# EAGLE schematic Konekt_Dash_Pro (EAGLE 6.5.0)
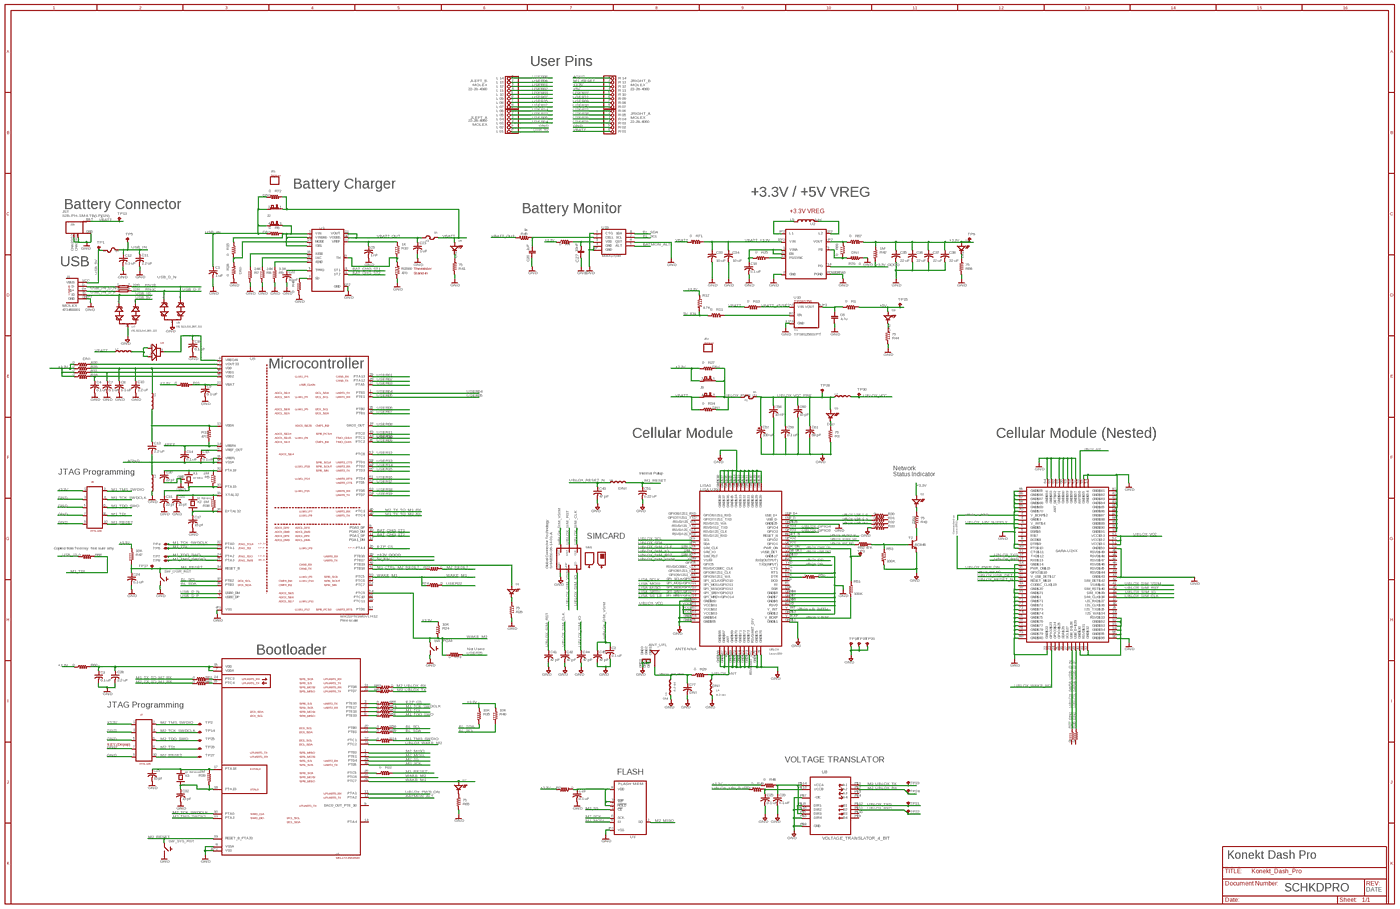
[diagram p0: schematic, sheet 1, overview]
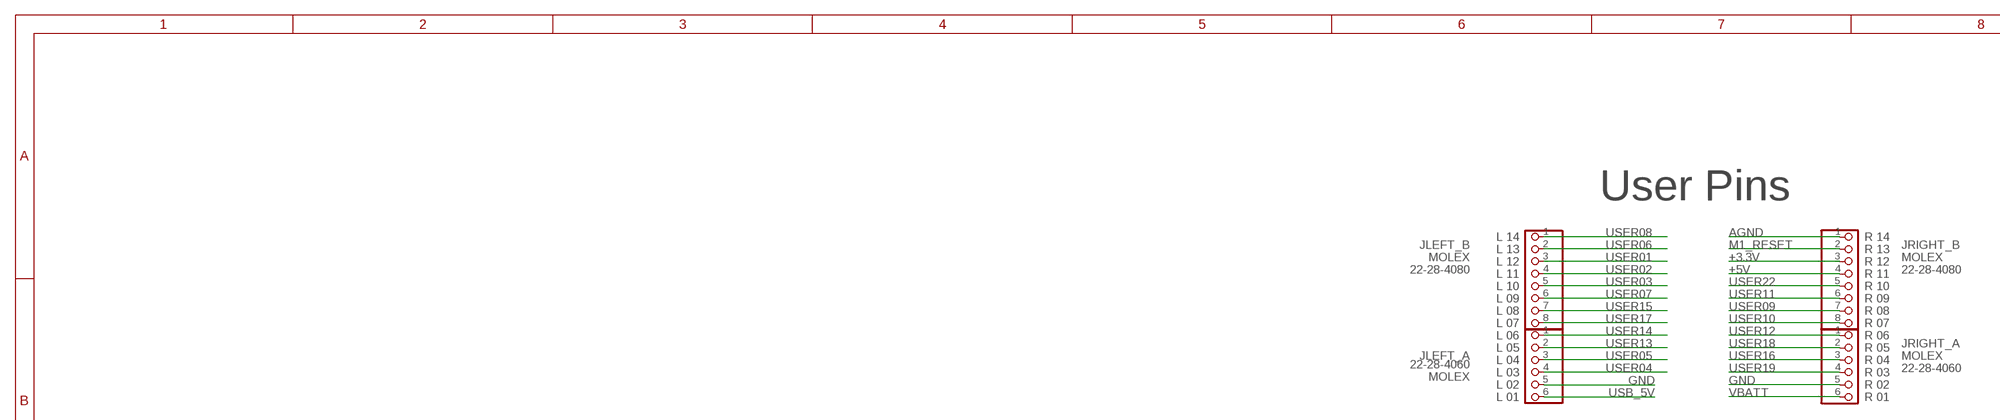
[diagram p1: schematic, sheet 1, part 1 of 4]
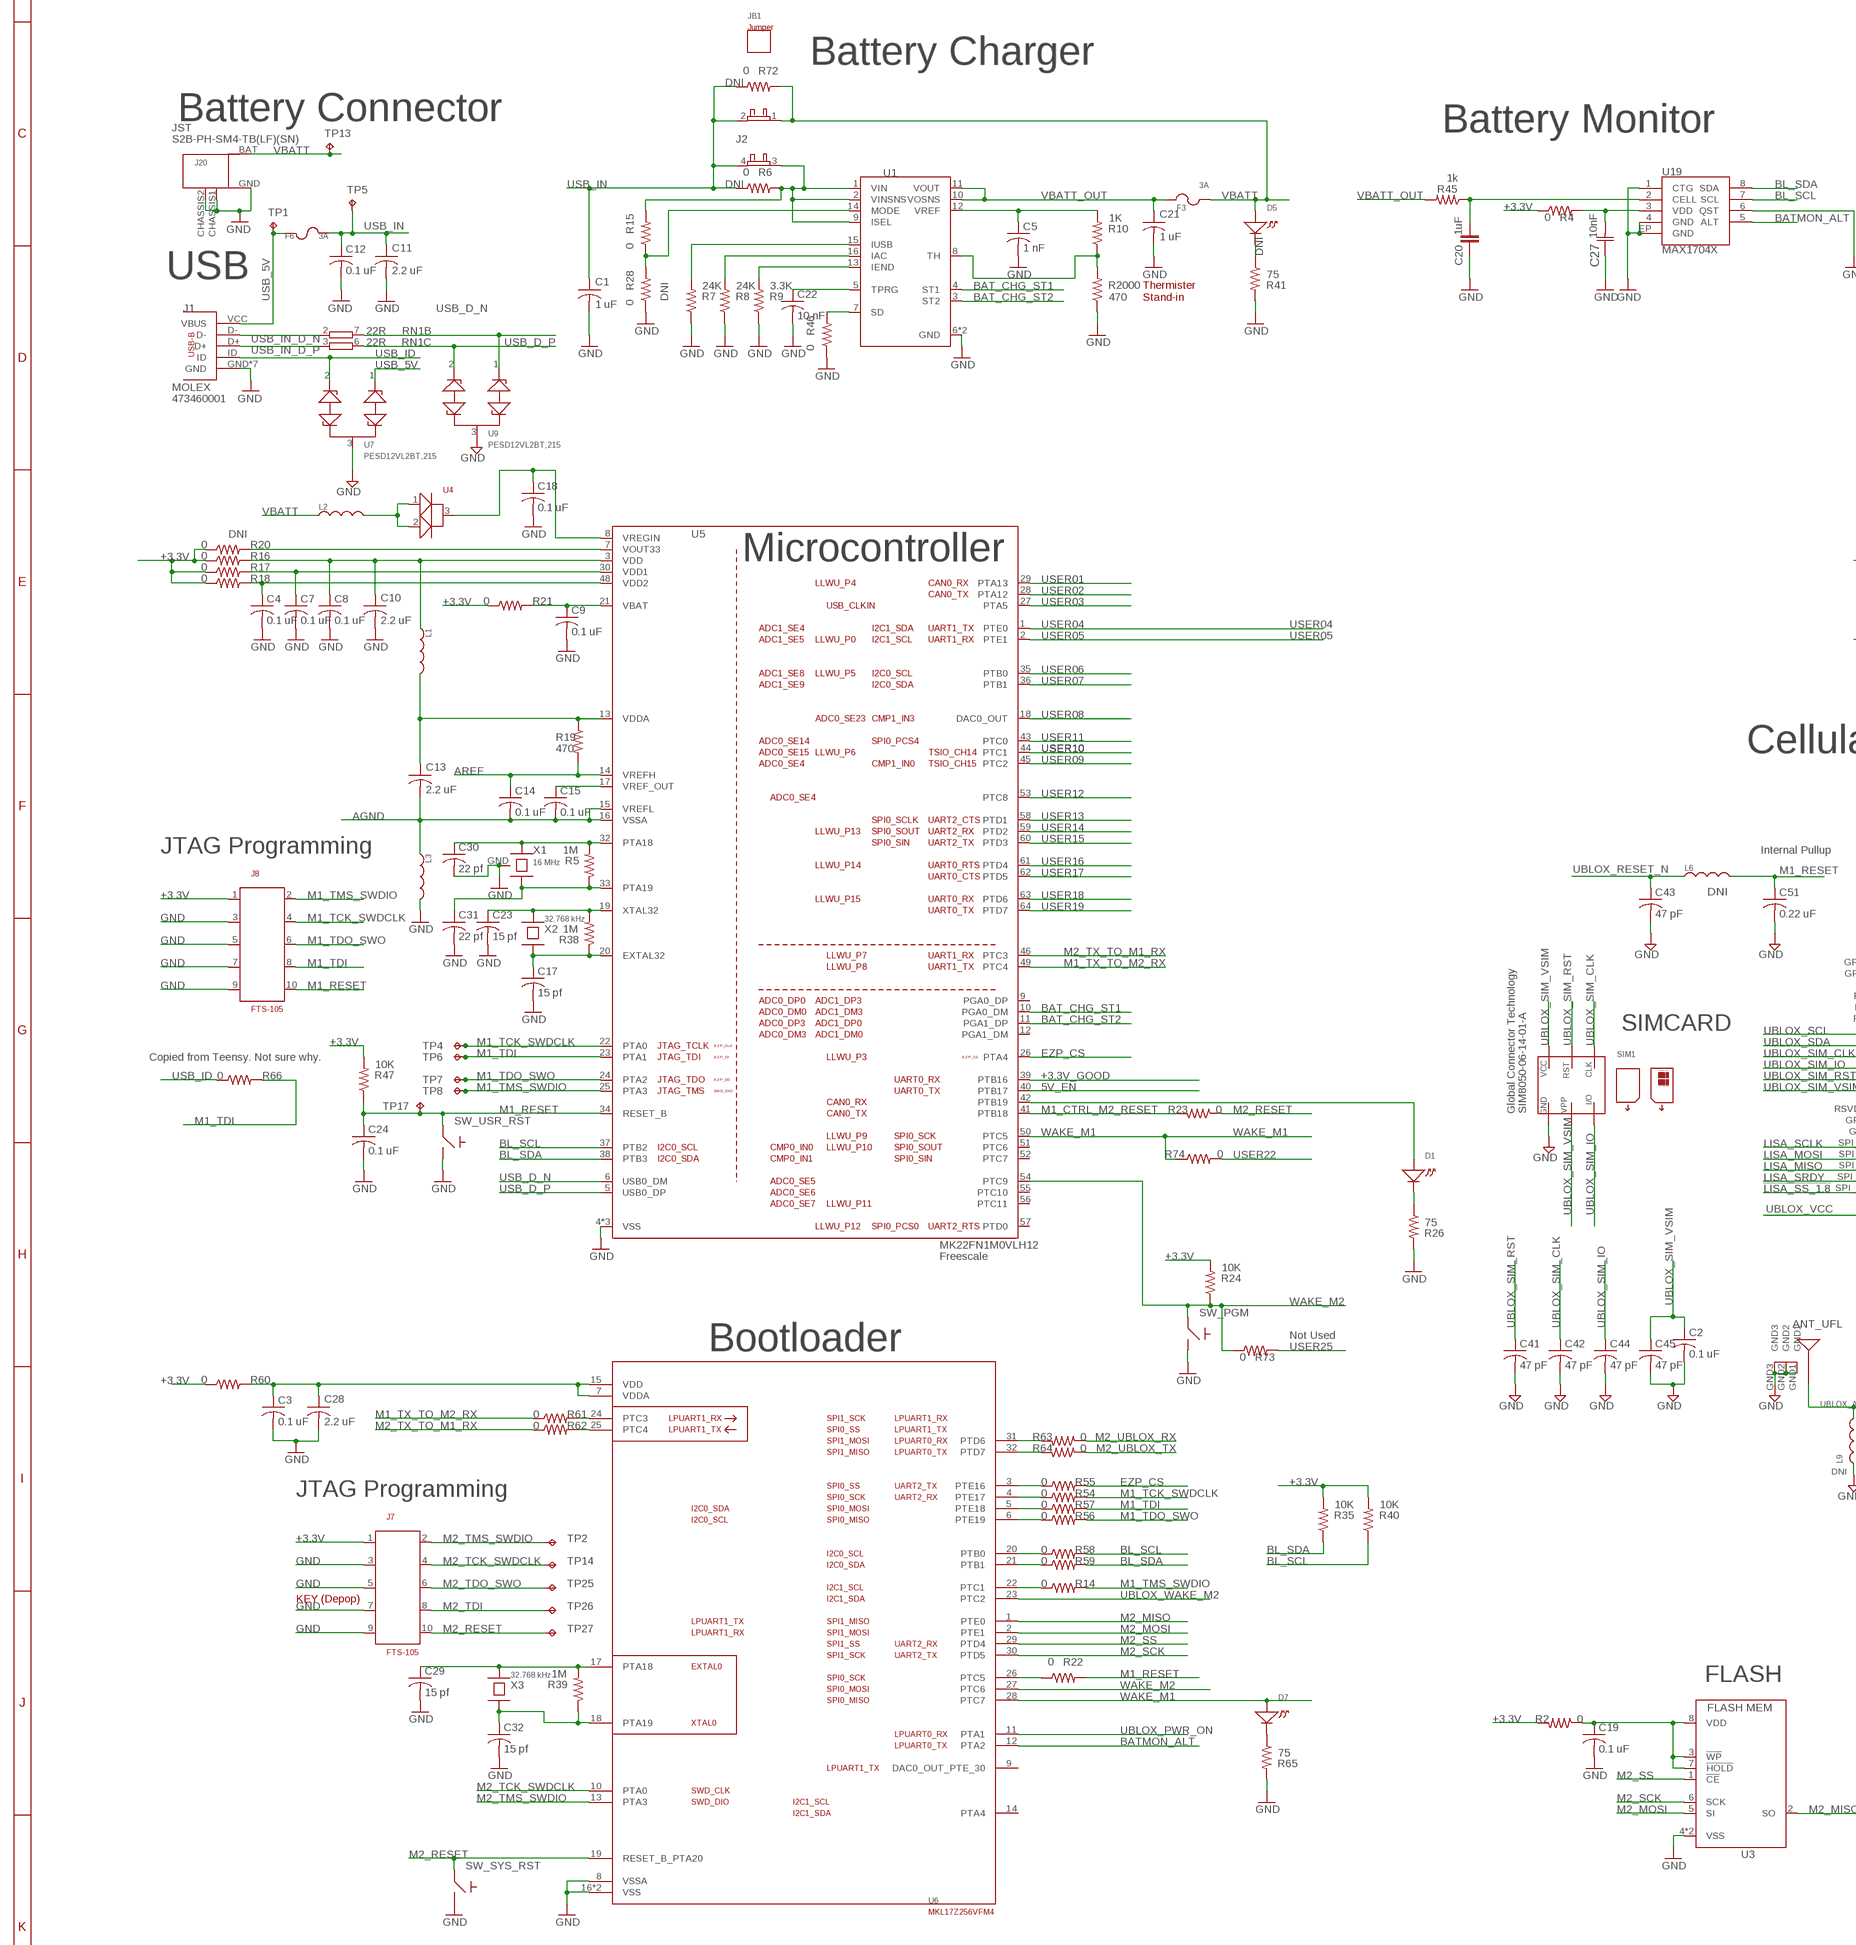
[diagram p2: schematic, sheet 1, part 2 of 4]
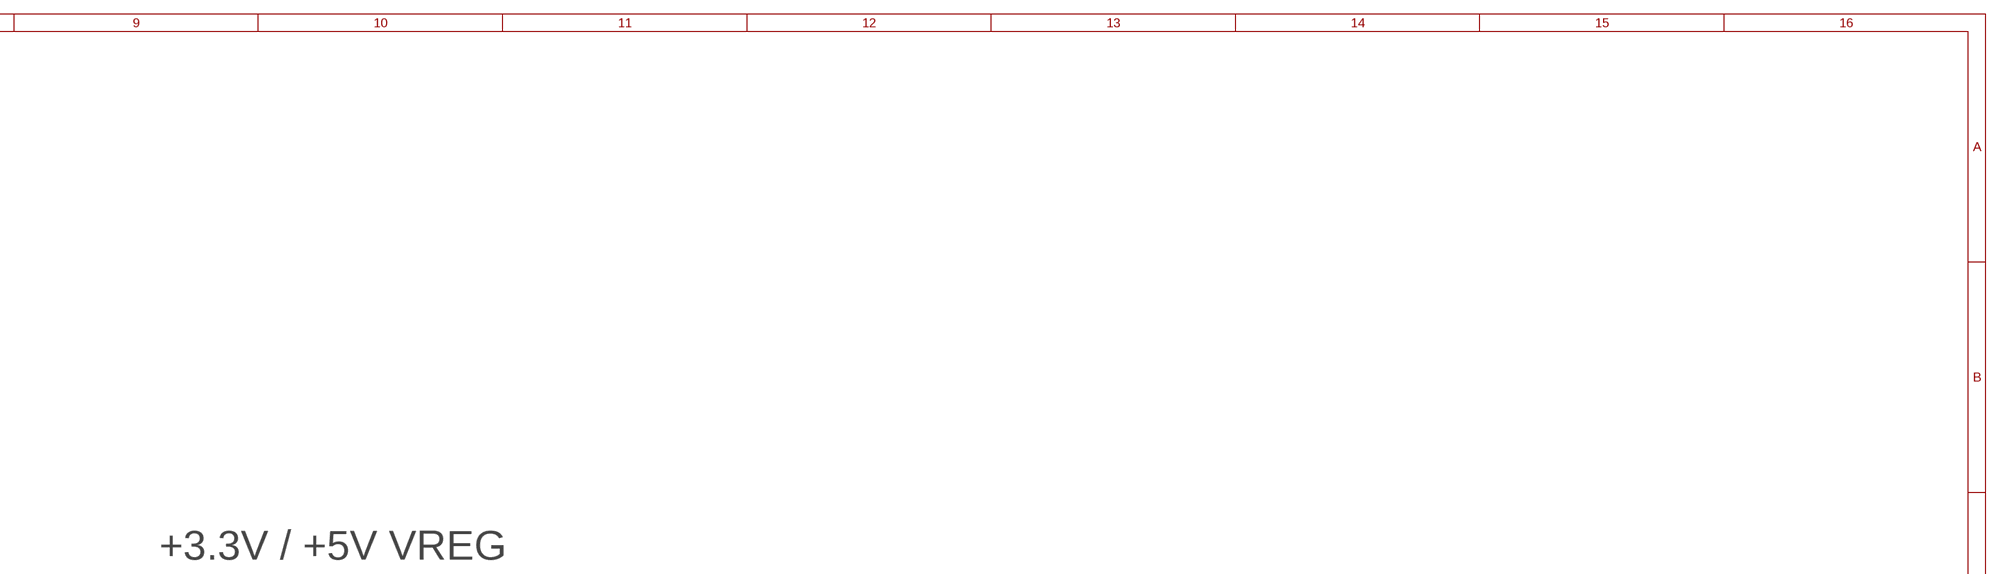
[diagram p3: schematic, sheet 1, part 3 of 4]
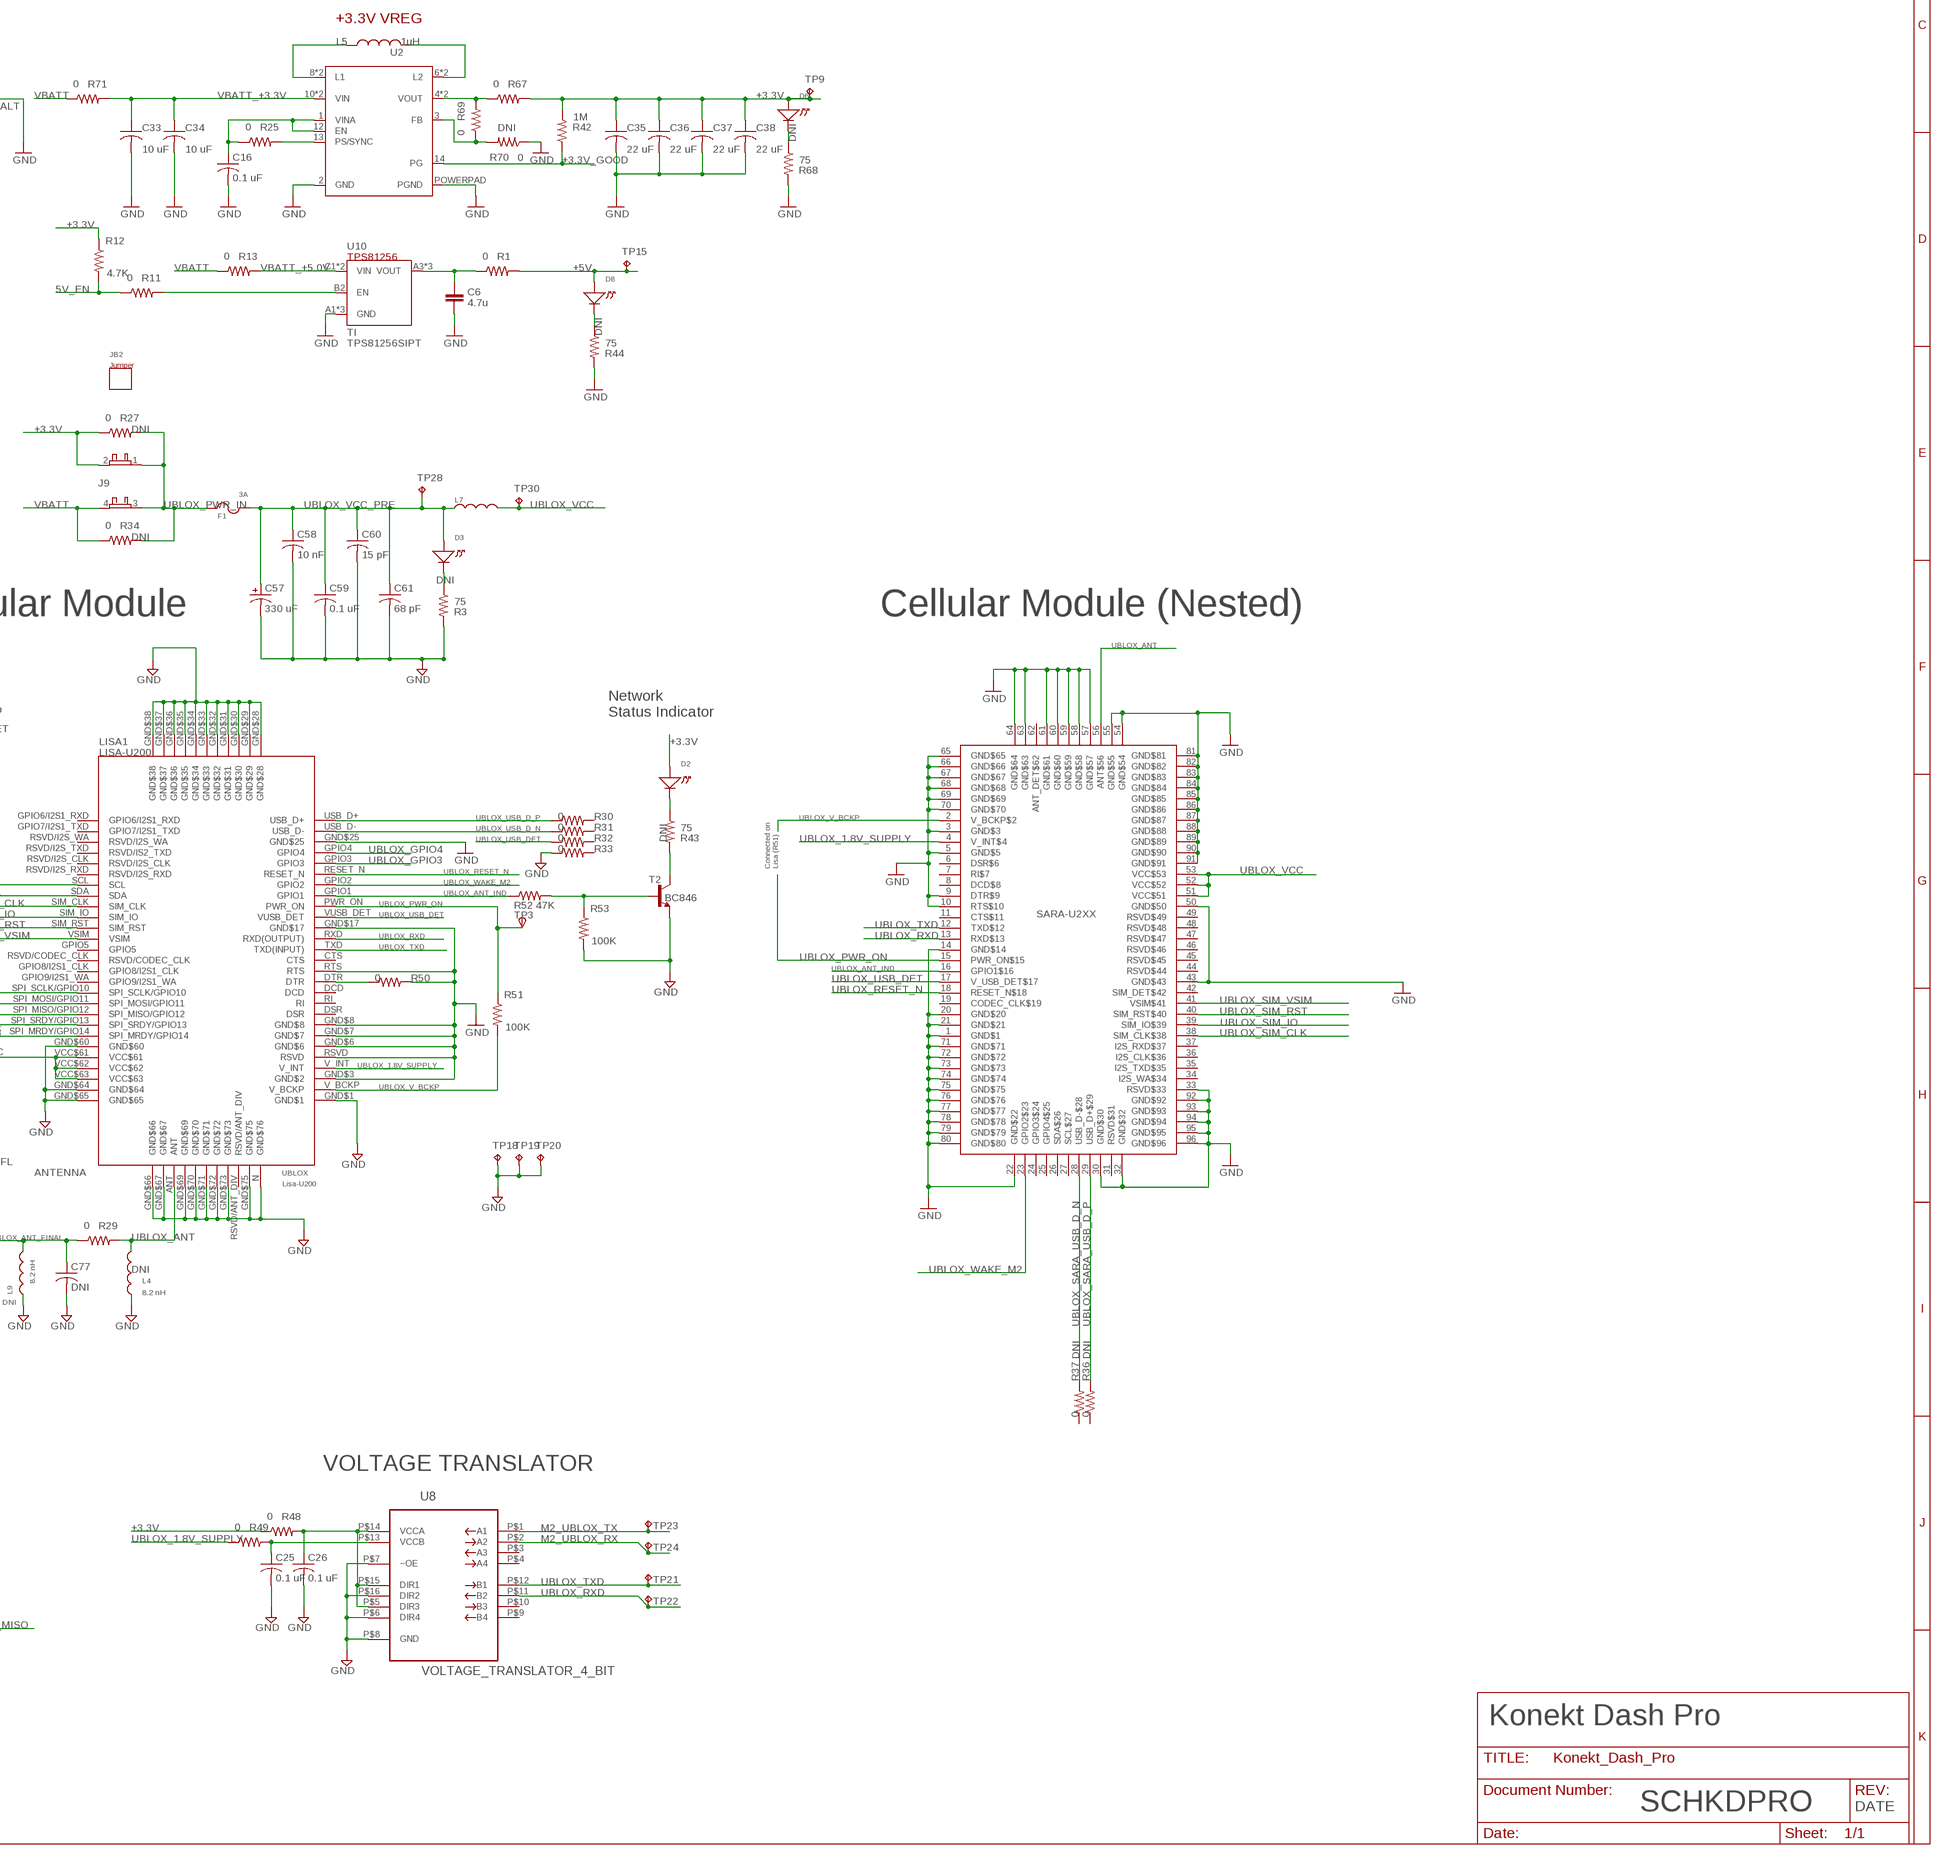
[diagram p4: schematic, sheet 1, part 4 of 4]

## Parts
ANT_UFL  ANT-A-1JB  [UFL]
C1  1 uF  C-USC0603  [C0603]
C2  0.1 uF  C-USC0402  [C0402]
C3  0.1 uF  C-USC0402  [C0402]
C4  0.1 uF  C-USC0402  [C0402]
C5  1 nF  C-USC0402  [C0402]
C6  4.7u  C-EU0603-RND  [C0603-ROUND]
C7  0.1 uF  C-USC0402  [C0402]
C8  0.1 uF  C-USC0402  [C0402]
C9  0.1 uF  C-USC0402  [C0402]
C10  2.2 uF  C-USC0603  [C0603]
C11  2.2 uF  C-USC0603  [C0603]
C12  0.1 uF  C-USC0603  [C0603]
C13  2.2 uF  C-USC0603  [C0603]
C14  0.1 uF  C-USC0402  [C0402]
C15  0.1 uF  C-USC0402  [C0402]
C16  0.1 uF  C-USC0603  [C0603]
C17  15 pf  C-USC0402  [C0402]
C18  0.1 uF  C-USC0402  [C0402]
C19  0.1 uF  C-USC0402  [C0402]
C20  1uF  CAPACITOR0402  [0402-CAP]
C21  1 uF  C-USC0603  [C0603]
C22  10 nF  C-USC0402  [C0402]
C23  15 pf  C-USC0402  [C0402]
C24  0.1 uF  C-USC0402  [C0402]
C25  0.1 uF  C-USC0402  [C0402]
C26  0.1 uF  C-USC0402  [C0402]
C27  10nF  GRM155R71E103KA01D  [CAPC1005X60N]
C28  2.2 uF  C-USC0603  [C0603]
C29  15 pf  C-USC0402  [C0402]
C30  22 pf  C-USC0402  [C0402]
C31  22 pf  C-USC0402  [C0402]
C32  15 pf  C-USC0402  [C0402]
C33  10 uF  C-USC0603  [C0603]
C34  10 uF  C-USC0603  [C0603]
C35  22 uF  C-USC0603  [C0603]
C36  22 uF  C-USC0603  [C0603]
C37  22 uF  C-USC0603  [C0603]
C38  22 uF  C-USC0603  [C0603]
C41  47 pF  C-USC0402  [C0402]
C42  47 pF  C-USC0402  [C0402]
C43  47 pF  C-USC0402  [C0402]
C44  47 pF  C-USC0402  [C0402]
C45  47 pF  C-USC0402  [C0402]
C51  0.22 uF  C-USC0603  [C0603]
C57  330 uF  CAP_SMD_D_SIZED  [CAP_SMD_SIZE_D]
C58  10 nF  C-USC0402  [C0402]
C59  0.1 uF  C-USC0603  [C0603]
C60  15 pF  C-USC0402  [C0402]
C61  68 pF  C-USC0402  [C0402]
C77  DNI  C-USC0402  [C0402]
D1  LED_0402_VLMW  [LED_0402_VISHAY_VLMW]
D2  LED_0402_VLMW  [LED_0402_VISHAY_VLMW]
D3  LED_0402_VLMW  [LED_0402_VISHAY_VLMW]
D5  LED_0402_VLMW  [LED_0402_VISHAY_VLMW]
D6  LED_0402_VLMW  [LED_0402_VISHAY_VLMW]
D7  LED_0402_VLMW  [LED_0402_VISHAY_VLMW]
D8  LED_0402_VLMW  [LED_0402_VISHAY_VLMW]
F1  3A  FUSE_0603  [R0603]
F3  3A  FUSE_0603  [R0603]
F6  3A  FUSE_0603  [R0603]
J1  USB_MICRO_B_MOLEX_473460001  [USB_MICRO_MOLEX_473460001]
J2  CON_JUMPER_1.27_2X2  [FCI_CON_1.27_2X2]
J7  FTS-105  [FTS-105]
J8  FTS-105  [FTS-105]
J9  CON_JUMPER_1.27_2X2  [FCI_CON_1.27_2X2]
J20  BAT_TERM  [JST-PH-2]
JB1  JUMPER_1.27MM  [NOTHING]
JB2  JUMPER_1.27MM  [NOTHING]
JLEFT_A  PINHD-1X6  [1X06]
JLEFT_B  HEADER_0.1_IN_8_POS  [HEADER_0.1_8_POS]
JRIGHT_A  PINHD-1X6  [1X06]
JRIGHT_B  HEADER_0.1_IN_8_POS  [HEADER_0.1_8_POS]
L1  INDUCTOR_0603  [R0603$1]
L2  INDUCTOR_0603  [R0603$1]
L3  INDUCTOR_0603  [R0603$1]
L4  INDUCTOR_0402  [R0402]
L5  1uH  INDUCTOR_1UH_XFL4020-102MEC  [COILCRAFT_XFL4020]
L6  INDUCTOR_0603  [R0603$1]
L7  INDUCTOR_0603  [R0603$1]
L9  INDUCTOR_0402  [R0402]
LISA1  LISA-U200  [76PIN_LCC]
R1  0  RESISTOR0402-RES  [0402-RES]
R2  0  RESISTOR0402-RES  [0402-RES]
R3  75  RESISTOR0402-RES  [0402-RES]
R4  0  RESISTOR0402-RES  [0402-RES]
R5  1M  RESISTOR0402-RES  [0402-RES]
R6  0  RESISTOR0402-RES  [0402-RES]
R7  24K  RESISTOR0402-RES  [0402-RES]
R8  24K  RESISTOR0402-RES  [0402-RES]
R9  3.3K  RESISTOR0402-RES  [0402-RES]
R10  1K  RESISTOR0402-RES  [0402-RES]
R11  0  RESISTOR0402-RES  [0402-RES]
R12  4.7K  R-US_R0402  [R0402]
R13  0  RESISTOR0402-RES  [0402-RES]
R14  0  RESISTOR0402-RES  [0402-RES]
R15  0  RESISTOR0402-RES  [0402-RES]
R16  0  RESISTOR0402-RES  [0402-RES]
R17  0  RESISTOR0402-RES  [0402-RES]
R18  0  RESISTOR0402-RES  [0402-RES]
R19  470  R-US_R0402  [R0402]
R20  0  RESISTOR0402-RES  [0402-RES]
R21  0  RESISTOR0402-RES  [0402-RES]
R22  0  RESISTOR0402-RES  [0402-RES]
R23  0  RESISTOR0402-RES  [0402-RES]
R24  10K  RESISTOR0402-RES  [0402-RES]
R25  0  RESISTOR0402-RES  [0402-RES]
R26  75  RESISTOR0402-RES  [0402-RES]
R27  0  RESISTOR0402-RES  [0402-RES]
R28  0  RESISTOR0402-RES  [0402-RES]
R29  0  RESISTOR0402-RES  [0402-RES]
R30  0  RESISTOR0402-RES  [0402-RES]
R31  0  RESISTOR0402-RES  [0402-RES]
R32  0  RESISTOR0402-RES  [0402-RES]
R33  0  RESISTOR0402-RES  [0402-RES]
R34  0  RESISTOR0402-RES  [0402-RES]
R35  10K  RESISTOR0402-RES  [0402-RES]
R36  0  RESISTOR0402-RES  [0402-RES]
R37  0  RESISTOR0402-RES  [0402-RES]
R38  1M  RESISTOR0402-RES  [0402-RES]
R39  1M  RESISTOR0402-RES  [0402-RES]
R40  10K  RESISTOR0402-RES  [0402-RES]
R41  75  RESISTOR0402-RES  [0402-RES]
R42  1M  RESISTOR0402-RES  [0402-RES]
R43  75  RESISTOR0402-RES  [0402-RES]
R44  75  RESISTOR0402-RES  [0402-RES]
R45  1k  RESISTOR  [0402-RES]
R46  0  RESISTOR0402-RES  [0402-RES]
R47  10K  RESISTOR0402-RES  [0402-RES]
R48  0  RESISTOR0402-RES  [0402-RES]
R49  0  RESISTOR0402-RES  [0402-RES]
R50  0  RESISTOR0402-RES  [0402-RES]
R51  100K  R-US_R0402  [R0402]
R52  47K  R-US_R0402  [R0402]
R53  100K  R-US_R0402  [R0402]
R54  0  RESISTOR0402-RES  [0402-RES]
R55  0  RESISTOR0402-RES  [0402-RES]
R56  0  RESISTOR0402-RES  [0402-RES]
R57  0  RESISTOR0402-RES  [0402-RES]
R58  0  RESISTOR0402-RES  [0402-RES]
R59  0  RESISTOR0402-RES  [0402-RES]
R60  0  RESISTOR0402-RES  [0402-RES]
R61  0  RESISTOR0402-RES  [0402-RES]
R62  0  RESISTOR0402-RES  [0402-RES]
R63  0  RESISTOR0402-RES  [0402-RES]
R64  0  RESISTOR0402-RES  [0402-RES]
R65  75  RESISTOR0402-RES  [0402-RES]
R66  0  RESISTOR0402-RES  [0402-RES]
R67  0  RESISTOR0402-RES  [0402-RES]
R68  75  RESISTOR0402-RES  [0402-RES]
R69  0  RESISTOR0402-RES  [0402-RES]
R70  0  RESISTOR0402-RES  [0402-RES]
R71  0  RESISTOR0402-RES  [0402-RES]
R72  0  RESISTOR0402-RES  [0402-RES]
R73  0  RESISTOR0402-RES  [0402-RES]
R74  0  RESISTOR0402-RES  [0402-RES]
R2000  470  RESISTOR0402-RES  [0402-RES]
RN1  22R  4R-NCAY16  [CAY16]
SARA1  SARA-U2XX  [91-PIN_LGA]
SIM1  SIM_CARD_NANO_GLOBAL_CONNECTOR_TEC_SIM8050-6-0-14-01-A  [SIM_CARD_NANO]
SW_PGM  SWITCH_PANASONIC_EVP-BB2A1B000  [SWITCH_PANASONIC_EVPBB]
SW_SYS_RST  SWITCH_PANASONIC_EVP-BB2A1B000  [SWITCH_PANASONIC_EVPBB]
SW_USR_RST  SWITCH_PANASONIC_EVP-BB2A1B000  [SWITCH_PANASONIC_EVPBB]
T2  BC846  [SOT23]
TP1  TPTP08R  [TP08R]
TP2  TPTP08R  [TP08R]
TP3  TPSTP09R  [TP09R]
TP4  TPTP08R  [TP08R]
TP5  TPTP08R  [TP08R]
TP6  TPTP08R  [TP08R]
TP7  TPTP08R  [TP08R]
TP8  TPTP08R  [TP08R]
TP9  TPTP08R  [TP08R]
TP13  TPTP08R  [TP08R]
TP14  TPTP08R  [TP08R]
TP15  TPTP08R  [TP08R]
TP17  TPTP08R  [TP08R]
TP18  TPTP08R  [TP08R]
TP19  TPTP08R  [TP08R]
TP20  TPTP08R  [TP08R]
TP21  TPTP08R  [TP08R]
TP22  TPTP08R  [TP08R]
TP23  TPTP08R  [TP08R]
TP24  TPTP08R  [TP08R]
TP25  TPTP08R  [TP08R]
TP26  TPTP08R  [TP08R]
TP27  TPTP08R  [TP08R]
TP28  TPTP08R  [TP08R]
TP30  TPTP08R  [TP08R]
U1  ST_MICRO_BAT_CHARGER_L6924U013  [BAT_CHARGE_ST_MICRO_L6924U]
U2  TPS63021  [QFN-14-POWERPAD3X4DSJ]
U3  MICROCHIP_FLASH_MEM  [TDFN8_5X6]
U4  DIODE_DUAL_SCHOTKEY  [SOT23-3]
U5  MK20DX128VLH5  [MK20DX128VLH5]
U6  FREESCALE_MKL17Z256VFM4  [QFN_32_5X5]
U7  PESD12VL2BT,215  [SOT23]
U8  VOLTAGE_TRANSLATOR_4_BIT  [UQFN_16]
U9  PESD12VL2BT,215  [SOT23]
U10  BOOST_5V_TI_TPS81256  [MICRO_SIP_3X3]
U19  MAX1704X  [TDFN-8]
X1  16 MHz  CERAMIC_RESONATOR_16MHZ_MURATA_CSTCE  [CRYSTAL_RESONATOR_MURATA_CSTCE]
X2  32.768 kHz  CRYSTAL_32.768K_AVX  [CRYSTAL_ST3215SB]
X3  32.768 kHz  CRYSTAL_32.768K_AVX  [CRYSTAL_ST3215SB]

## Nets
5V_EN: R11.1 R12.2 U5.40(PTB17)
!LISA_SS_1.8 [HIGH_SPEED]: LISA1.SPI_MRDY/GPIO14
+3.3V: C35.1 C36.1 C37.1 C38.1 D2.ANODE D6.ANODE J7.1 J8.1 J9.2 JRIGHT_B.3 R2.2 R4.1 R12.1 R16.1 R17.1 R18.1 R20.1 R21.1 R24.2 R27.1 R35.2 R40.2 R42.2 R47.2 R48.1 R60.1 R67.2 TP9.TP
+3.3V_FLASH: C19.1 R2.1 U3.3(!WP) U3.7(!HOLD) U3.8(VDD)
+3.3V_GOOD: R42.1 U2.14(PG) U5.39(PTB16)
+5V: D8.ANODE JRIGHT_B.4 R1.2 TP15.TP
AGND: C13.2 C14.2 C15.2 JRIGHT_B.1 L3.1 U5.15(VREFL) U5.16(VSSA)
AREF: C14.1 R19.2 U5.14(VREFH)
BAT_CHG_ST1: U1.4(ST1) U5.10(PGA0_DM)
BAT_CHG_ST2: U1.3(ST2) U5.11(PGA1_DP)
BATMON_ALT: U6.12(PTA2) U19.5(ALT)
BL_SCL [HIGH_SPEED]: R40.1 R58.2 U5.37(PTB2) U19.7(SCL)
BL_SDA [HIGH_SPEED]: R35.1 R59.2 U5.38(PTB3) U19.8(SDA)
EZP_CS: R55.2 U5.26(PTA4)
GND [gnd]: ANT_UFL.GND1 ANT_UFL.GND2 ANT_UFL.GND3 C1.2 C2.2 C3.2 C4.2 C5.2 C6.1 C7.2 C8.2 C9.2 C10.2 C11.2 C12.2 C16.2 C17.2 C18.2 C19.2 C20.2 C21.2 C22.2 C23.2 C24.2 C25.2 C26.2 C27.1(C1) C28.2 C29.2 C30.2 C31.2 C32.2 C33.2 C34.2 C35.2 C36.2 C37.2 C38.2 C41.2 C42.2 C43.2 C44.2 C45.2 C51.2 C57.P$2(NEG) C58.2 C59.2 C60.2 C61.2 C77.2 J1.GND J1.GND$1(GND) J1.GND$2(GND) J1.GND$3(GND) J1.GND$4(GND) J1.GND$5(GND) J1.GND$6(GND) J7.3 J7.5 J7.7 J7.9 J8.3 J8.5 J8.7 J8.9 J20.CHASSIS1(CHASSIS_1) J20.CHASSIS2(CHASSIS_2) J20.GND JLEFT_A.5 JRIGHT_A.5 L3.2 L4.2 L9.2 LISA1.GND$1 LISA1.GND$3(GND$2) LISA1.GND$6 LISA1.GND$7 LISA1.GND$8 LISA1.GND$17 LISA1.GND$25 LISA1.GND$28 LISA1.GND$29 LISA1.GND$30 LISA1.GND$31 LISA1.GND$32 LISA1.GND$33 LISA1.GND$34 LISA1.GND$35 LISA1.GND$36 LISA1.GND$37 LISA1.GND$38 LISA1.GND$60 LISA1.GND$64 LISA1.GND$65 LISA1.GND$66 LISA1.GND$67 LISA1.GND$69 LISA1.GND$70 LISA1.GND$71 LISA1.GND$72 LISA1.GND$73 LISA1.GND$75 LISA1.N(GND$76) LISA1.RSVD LISA1.RTS R3.2 R7.1 R8.1 R9.1 R26.2 R28.1 R33.1 R41.2 R44.2 R46.1 R50.2 R53.2 R65.2 R68.2 R70.1 R2000.1 SARA1.1(GND$1) SARA1.3(GND$3) SARA1.5(GND$5) SARA1.9(DTR$9) SARA1.10(RTS$10) SARA1.14(GND$14) SARA1.20(GND$20) SARA1.21(GND$21) SARA1.22(GND$22) SARA1.30(GND$30) SARA1.32(GND$32) SARA1.33(RSVD$33) SARA1.43(GND$43) SARA1.50(GND$50) SARA1.54(GND$54) SARA1.55(GND$55) SARA1.57(GND$57) SARA1.58(GND$58) SARA1.59(GND$59) SARA1.60(GND$60) SARA1.61(GND$61) SARA1.63(GND$63) SARA1.64(GND$64) SARA1.65(GND$65) SARA1.66(GND$66) SARA1.67(GND$67) SARA1.68(GND$68) SARA1.69(GND$69) SARA1.70(GND$70) SARA1.71(GND$71) SARA1.72(GND$72) SARA1.73(GND$73) SARA1.74(GND$74) SARA1.75(GND$75) SARA1.76(GND$76) SARA1.77(GND$77) SARA1.78(GND$78) SARA1.79(GND$79) SARA1.80(GND$80) SARA1.81(GND$81) SARA1.82(GND$82) SARA1.83(GND$83) SARA1.84(GND$84) SARA1.85(GND$85) SARA1.86(GND$86) SARA1.87(GND$87) SARA1.88(GND$88) SARA1.89(GND$89) SARA1.90(GND$90) SARA1.91(GND$91) SARA1.92(GND$92) SARA1.93(GND$93) SARA1.94(GND$94) SARA1.95(GND$95) SARA1.96(GND$96) SIM1.C5-GND(GND) SW_PGM.B SW_PGM.B2 SW_SYS_RST.B SW_SYS_RST.B2 SW_USR_RST.B SW_USR_RST.B2 T2.2(E) TP18.TP TP19.TP TP20.TP U1.6(GND) U1.PAD(GND) U2.2(GND) U2.POWERPAD(PGND) U3.4(VSS) U3.P$9(VSS) U5.4(VSS) U5.31(VSS) U5.47(VSS) U6.8(VSSA) U6.16(VSS) U6.PAD(VSS) U7.3 U8.P$6(DIR4) U8.P$7(~OE) U8.P$8(GND) U8.P$16(DIR2) U9.3 U10.A1(GND) U10.A2(GND) U10.B1(GND) U19.1(CTG) U19.4(GND) U19.6(QST) U19.EP(GND) X1.GND
LISA_MISO [HIGH_SPEED]: LISA1.SPI_MISO/GPIO12
LISA_MOSI [HIGH_SPEED]: LISA1.SPI_MOSI/GPIO11
LISA_SCLK [HIGH_SPEED]: LISA1.SPI_SCLK/GPIO10
LISA_SRDY [HIGH_SPEED]: LISA1.SPI_SRDY/GPIO13
M1_CTRL_M2_RESET: R23.2 U5.41(PTB18)
M1_RESET: C24.1 C51.1 J8.10 JRIGHT_B.2 L6.2 R22.2 R47.1 SW_USR_RST.A SW_USR_RST.A2 TP17.TP U5.34(RESET_B)
M1_TCK_SWDCLK: J8.4 R54.2 TP4.TP U5.22(PTA0)
M1_TDI: J8.8 R57.2 R66.2 TP6.TP U5.23(PTA1)
M1_TDO_SWO: J8.6 R56.2 TP7.TP U5.24(PTA2)
M1_TMS_SWDIO: J8.2 R14.2 TP8.TP U5.25(PTA3)
M1_TX_TO_M2_RX: R61.1 U5.49(PTC4)
M2_MISO: U3.2(SO) U6.1(PTE0)
M2_MOSI: U3.5(SI) U6.2(PTE1)
M2_RESET: J7.10 R23.1 SW_SYS_RST.A SW_SYS_RST.A2 TP27.TP U6.19(RESET_B_PTA20)
M2_RX: R61.2 U6.24(PTC3)
M2_SCK: U3.6(SCK) U6.30(PTD5)
M2_SPI0_MISO: R56.1 U6.6(PTE19)
M2_SPI0_MOSI: R57.1 U6.5(PTE18)
M2_SS: U3.1(!CE) U6.29(PTD4)
M2_TCK_SWDCLK: J7.4 TP14.TP U6.10(PTA0)
M2_TDI: J7.8 TP26.TP
M2_TDO_SWO: J7.6 TP25.TP
M2_TMS_SWDIO: J7.2 TP2.TP U6.13(PTA3)
M2_TX: R62.2 U6.25(PTC4)
M2_TX_TO_M1_RX: R62.1 U5.46(PTC3)
M2_UBLOX_RX: R63.1 TP24.TP U8.P$2(A2)
M2_UBLOX_TX: R64.1 TP23.TP U8.P$1(A1)
N$1: C20.1 R45.1 U19.2(CELL)
N$2: D1.ANODE U5.42(PTB19)
N$3: C27.2(C2) R4.2 U19.3(VDD)
N$4: J2.3 R6.2 R15.2 U1.1(VIN) U1.2(VINSNS) U1.9(ISEL)
N$5: R10.1 R2000.2 U1.8(TH)
N$6: C5.1 R10.2 U1.12(VREF)
N$7: D3.CATHODE R3.1
N$8: R7.2 U1.15(IUSB)
N$9: L5.P$1 U2.8(L1) U2.9(L1)
N$10: R8.2 U1.16(IAC)
N$11: C30.1 R5.2 U5.32(PTA18) X1.XTAL1
N$12: R9.2 U1.13(IEND)
N$13: D5.CATHODE R41.1
N$14: C22.1 U1.5(TPRG)
N$15: C6.2 R1.1 U10.A3(VOUT) U10.B3(VOUT) U10.C3(VOUT)
N$16: R11.2 U10.B2(EN)
N$17: C8.1 C10.1 L1.1 R16.2 U5.3(VDD)
N$18: C7.1 R17.2 U5.30(VDD1)
N$19: C4.1 R18.2 U5.48(VDD2)
N$20: C18.1 U4.3(C) U5.8(VREGIN)
N$21: R20.2 U5.7(VOUT33)
N$22: C15.1 U5.17(VREF_OUT)
N$23: C13.1 L1.2 R19.1 U5.13(VDDA)
N$24: D8.CATHODE R44.1
N$25: L2.2 U4.1(A1) U4.2(A2)
N$26 [gnd]: LISA1.DTR R50.1
N$27: C9.1 R21.2 U5.21(VBAT)
N$28: C31.1 R5.1 U5.33(PTA19) X1.XTAL2
N$29: C23.1 R38.2 U5.19(XTAL32) X2.P$2(XTAL2)
N$30: R58.1 U6.20(PTB0)
N$31: C17.1 R38.1 U5.20(EXTAL32) X2.P$1(XTAL1)
N$32: L5.P$2 U2.6(L2) U2.7(L2)
N$33: D1.CATHODE R26.1
N$34: C16.1 R25.1 U2.1(VINA) U2.12(EN)
N$35: R14.1 U6.22(PTC1)
N$36: R15.1 R28.2 U1.14(MODE)
N$37: R46.2 U1.7(SD)
N$38: R67.1 R69.2 U2.4(VOUT) U2.5(VOUT)
N$40: R63.2 U6.31(PTD6)
N$41: R64.2 U6.32(PTD7)
N$42: R55.1 U6.3(PTE16)
N$43: R54.1 U6.4(PTE17)
N$48: R59.1 U6.21(PTB1)
N$49: R22.1 U6.26(PTC5)
N$51: C3.1 C28.1 R60.2 U6.7(VDDA) U6.15(VDD)
N$56: D7.CATHODE R65.1
N$57: C32.1 R39.1 U6.18(PTA19) X3.P$1(XTAL1)
N$58: C29.1 R39.2 U6.17(PTA18) X3.P$2(XTAL2)
N$59: R25.2 U2.13(PS/SYNC)
N$60: D6.CATHODE R68.1
N$61: R69.1 R70.2 U2.3(FB)
N$73: D2.CATHODE R43.1
N$76: R52.2 R53.1 T2.1(B)
N$78: R43.2 T2.3(C)
UBLOX_1.8V_SUPPLY: LISA1.V_INT R49.1 SARA1.4(V_INT$4)
UBLOX_ANT [HIGH_SPEED]: L4.1 LISA1.ANT R29.2 SARA1.56(ANT$56)
UBLOX_ANT_FINAL [gnd]: ANT_UFL.SIGNAL C77.1 L9.1 R29.1
UBLOX_ANT_IND: LISA1.GPIO1 R52.1 SARA1.16(GPIO1$16)
UBLOX_GPIO3: LISA1.GPIO3
UBLOX_GPIO4: LISA1.GPIO4
UBLOX_PWR_IN: F1.2 J9.1 J9.3 R27.2 R34.2
UBLOX_PWR_ON: LISA1.PWR_ON R51.1 SARA1.15(PWR_ON$15) TP3.TP(PP) U6.11(PTA1)
UBLOX_RESET_N: C43.1 L6.1 LISA1.RESET_N SARA1.18(RESET_N$18)
UBLOX_RXD [HIGH_SPEED]: LISA1.RXD(RXD(OUTPUT)) SARA1.13(RXD$13) TP22.TP U8.P$11(B2)
UBLOX_SARA_USB_D_N [DIFF_HIGH_SPEED]: R37.2 SARA1.28(USB_D-$28)
UBLOX_SARA_USB_D_P [DIFF_HIGH_SPEED]: R36.2 SARA1.29(USB_D+$29)
UBLOX_SCL: LISA1.SCL
UBLOX_SDA: LISA1.SDA
UBLOX_SIM_CLK [HIGH_SPEED]: C42.1 LISA1.SIM_CLK SARA1.38(SIM_CLK$38) SIM1.C3-CLK(CLK)
UBLOX_SIM_IO [HIGH_SPEED]: C44.1 LISA1.SIM_IO SARA1.39(SIM_IO$39) SIM1.C7-IO(IO)
UBLOX_SIM_RST [HIGH_SPEED]: C41.1 LISA1.SIM_RST SARA1.40(SIM_RST$40) SIM1.C2-RST(RST)
UBLOX_SIM_VSIM [HIGH_SPEED]: C2.1 C45.1 LISA1.VSIM SARA1.41(VSIM$41) SIM1.C1-VCC(VCC) SIM1.C6-VPP(VCC2)
UBLOX_TXD [HIGH_SPEED]: LISA1.TXD(TXD(INPUT)) SARA1.12(TXD$12) TP21.TP U8.P$12(B1)
UBLOX_USB_D_N [DIFF_HIGH_SPEED]: LISA1.USB_D- R31.1
UBLOX_USB_D_P [DIFF_HIGH_SPEED]: LISA1.USB_D+ R30.1
UBLOX_USB_DET [Vbatt]: LISA1.VUSB_DET R32.1 SARA1.17(V_USB_DET$17)
UBLOX_V_BCKP: LISA1.V_BCKP R51.2 SARA1.2(V_BCKP$2)
UBLOX_VCC: L7.2 LISA1.VCC$61 LISA1.VCC$62 LISA1.VCC$63 SARA1.51(VCC$51) SARA1.52(VCC$52) SARA1.53(VCC$53) TP30.TP
UBLOX_VCC_PRE: C57.P$1(POS) C58.1 C59.1 C60.1 C61.1 D3.ANODE F1.1 L7.1 TP28.TP
UBLOX_WAKE_M2: LISA1.GPIO2 SARA1.23(GPIO2$23) U6.23(PTC2)
USB_5V: F6.1 J1.VCC(VBUS) JLEFT_A.6 TP1.TP U7.1
USB_D_N [DIFF_HIGH_SPEED]: RN1.7 U5.6(USB0_DM) U9.1
USB_D_P [DIFF_HIGH_SPEED]: RN1.6 U5.5(USB0_DP) U9.2
USB_ID: J1.ID R66.1 U7.2
USB_IN [Vbatt]: C1.1 C11.1 C12.1 F6.2 J2.2 J2.4 R6.1 R72.1 TP5.TP
USB_IN_D_N [DIFF_HIGH_SPEED]: J1.D- RN1.2
USB_IN_D_P [DIFF_HIGH_SPEED]: J1.D+ RN1.3
USER01 [HIGH_SPEED]: JLEFT_B.3 U5.29(PTA13)
USER02 [HIGH_SPEED]: JLEFT_B.4 U5.28(PTA12)
USER03 [HIGH_SPEED]: JLEFT_B.5 U5.27(PTA5)
USER04 [HIGH_SPEED]: JLEFT_A.4 U5.1(PTE0)
USER05 [HIGH_SPEED]: JLEFT_A.3 U5.2(PTE1)
USER06 [HIGH_SPEED]: JLEFT_B.2 U5.35(PTB0)
USER07 [HIGH_SPEED]: JLEFT_B.6 U5.36(PTB1)
USER08 [HIGH_SPEED]: JLEFT_B.1 U5.18(DAC0_OUT)
USER09 [HIGH_SPEED]: JRIGHT_B.7 U5.45(PTC2)
USER10 [HIGH_SPEED]: JRIGHT_B.8 U5.44(PTC1)
USER11 [HIGH_SPEED]: JRIGHT_B.6 U5.43(PTC0)
USER12 [HIGH_SPEED]: JRIGHT_A.1 U5.53(PTC8)
USER13 [HIGH_SPEED]: JLEFT_A.2 U5.58(PTD1)
USER14 [HIGH_SPEED]: JLEFT_A.1 U5.59(PTD2)
USER15 [HIGH_SPEED]: JLEFT_B.7 U5.60(PTD3)
USER16 [HIGH_SPEED]: JRIGHT_A.3 U5.61(PTD4)
USER17 [HIGH_SPEED]: JLEFT_B.8 U5.62(PTD5)
USER18 [HIGH_SPEED]: JRIGHT_A.2 U5.63(PTD6)
USER19 [HIGH_SPEED]: JRIGHT_A.4 U5.64(PTD7)
USER22 [HIGH_SPEED]: JRIGHT_B.5 R74.2
USER25: R73.2
VBATT: D5.ANODE F3.1 J2.1 J9.4 J20.BAT JRIGHT_A.6 L2.1 R13.1 R34.1 R71.1 R72.2 TP13.TP
VBATT_+3.3V [power]: C33.1 C34.1 R71.2 U2.10(VIN) U2.11(VIN)
VBATT_+5.0V [power]: R13.2 U10.C1(VIN) U10.C2(VIN)
VBATT_OUT: C21.1 F3.2 R45.2 U1.10(VOSNS) U1.11(VOUT)
VTL_+3.3V1: C26.1 R48.2 U8.P$5(DIR3) U8.P$14(VCCA) U8.P$15(DIR1)
VTL_LISA_VCC1: C25.1 R49.2 U8.P$13(VCCB)
WAKE_M1: D7.ANODE R74.1 U5.50(PTC5) U6.28(PTC7)
WAKE_M2: R24.1 R73.1 SW_PGM.A SW_PGM.A2 U5.54(PTC9) U6.27(PTC6)
Unconnected: LISA1.CTS LISA1.DCD LISA1.DSR LISA1.GPIO5 LISA1.GPIO6/I2S1_RXD LISA1.GPIO7/I2S1_TXD LISA1.GPIO8/I2S1_CLK LISA1.GPIO9/I2S1_WA LISA1.RI LISA1.RSVD/ANT_DIV LISA1.RSVD/CODEC_CLK LISA1.RSVD/I2S_CLK LISA1.RSVD/I2S_RXD LISA1.RSVD/I2S_TXD(RSVD/IS2_TXD) LISA1.RSVD/I2S_WA R30.2 R31.2 R32.2 R33.2 R36.1 R37.1 RN1.1 RN1.4 RN1.5 RN1.8 SARA1.6(DSR$6) SARA1.7(RI$7) SARA1.8(DCD$8) SARA1.11(CTS$11) SARA1.19(CODEC_CLK$19) SARA1.24(GPIO3$24) SARA1.36(I2S_CLK$36) SARA1.37(I2S_RXD$37) SARA1.42(SIM_DET$42) SARA1.44(RSVD$44) SARA1.45(RSVD$45) SARA1.46(RSVD$46) SARA1.47(RSVD$47) SARA1.48(RSVD$48) SARA1.49(RSVD$49) SIM1.MTG1(NC1) SIM1.MTG2(NC2) U5.9(PGA0_DP) U5.12(PGA1_DM) U5.51(PTC6) U5.52(PTC7) U5.55(PTC10) U5.56(PTC11) U5.57(PTD0) U6.9(DAC0_OUT_PTE_30) U6.14(PTA4) U8.P$3(A3) U8.P$4(A4) U8.P$9(B4) U8.P$10(B3)

## Notes on the sheet
- User Pins
- L 14 | R 14
- L 13 | R 13
- L 12 | R 12
- L 11 | R 11
- L 10 | R 10
- L 09 | R 09
- L 08 | R 08
- L 07 | R 07
- L 06 | R 06
- L 05 | R 05
- L 04 | R 04
- L 03 | R 03
- L 02 | R 02
- L 01 | R 01
- Battery Charger
- +3.3V / +5V VREG
- Battery Connector
- Battery Monitor | +3.3V VREG
- USB
- Thermister
  Stand-in
- Microcontroller
- Cellular Module | Cellular Module (Nested)
- JTAG Programming | Internal Pullup
- Network
  Status Indicator
- LISA1
- Connected on 
  Lisa (R51)
- SIMCARD
- EZP_CLK
- Copied from Teensy. Not sure why. | EZP_DI | EZP_CS
- EZP_D0
- SWD_DIO
- Not Used | ANTENNA
- Bootloader
- JTAG Programming
- KEY (Depop)
- VOLTAGE TRANSLATOR
- FLASH
- Konekt Dash Pro
- SCHKDPRO | DATE

## Power pins joined to a net without a drawn wire
ANT_DET$62: SARA1.62(ANT_DET$62)
GPIO4$25: SARA1.25(GPIO4$25)
I2S_TXD$35: SARA1.35(I2S_TXD$35)
I2S_WA$34: SARA1.34(I2S_WA$34)
RSVD$31: SARA1.31(RSVD$31)
SCL$27: SARA1.27(SCL$27)
SDA$26: SARA1.26(SDA$26)

## Library data of the parts
ANT_UFL = DDL:ANT-A-1JB; MFG: AMPHENOL; MPN: A-1JB; PACKAGE: UFL; PARTNUM: A-1JB
C1 C21 = resistor:C-US: CAPACITOR, American symbol; MFG: MURATA; MPN: GRM188R71C105KA12D; PKG: 0603
C2-C4 C7-C9 C14 C18 C19 C24-C26 = konekt:C-US: CAPACITOR, American symbol; MFG: MURATA; MPN: GRM155R61C104KA88D; PACKAGE: 0402
C5 = resistor:C-US: CAPACITOR, American symbol; MFG: MURATA; MPN: GRM319R71H102KA01D; PKG: 0402
C6 = SmartPrj:C-EU: CAPACITOR, European symbol; MFG: MURATA; MPN: GRM188R61C475KAAJD; PACKAGE: 0603
C10 C11 C13 C28 = resistor:C-US: CAPACITOR, American symbol; MFG: SAMSUNG; MPN: CL10A225MQ8NNNC; PKG: 0603
C12 C16 C59 = resistor:C-US: CAPACITOR, American symbol; MFG: AVX; MPN: 0603YC104KAT2A; PARTNUM: 0603YC104KAT2A; PKG: 0603
C15 = konekt:C-US: CAPACITOR, American symbol; MFG: AVX/ELCO; MPN: GRM155R61C104KA88D; PACKAGE: 0402
C17 C23 C29 C32 = konekt:C-US: CAPACITOR, American symbol; MFG: AVX/ELCO; MPN: 04025A150JAT2A; PACKAGE: 0402
C20 = LooseLib1:CAPACITOR; CROSS: YES; DESCRIPTION: Capacitor, 10%, 50V; MFG: AVX; MPN: 04026D105KAT2A; PRODUCTION: YES; TOLERANCE: 10%; VOLTAGE: 50V
C22 C58 = resistor:C-US: CAPACITOR, American symbol; MFG: MURATA; MPN: GRM155R71C103KA01D; PKG: 0402
C27 = Murata_By_element14_Batch_1:GRM155R71E103KA01D: CAPACITOR, 0402; CROSS: YES; DESCRIPTION: CAPACITOR, 0402; MFG: Murata; MPN: GRM155R71E103KA01D; OC_FARNELL: 8819734; OC_NEWARK: 37K6460; PRODUCTION: YES; SUPPLIER: Murata; TOLERANCE: ±10%; VOLTAGERATING: 25V
C30 C31 = konekt:C-US: CAPACITOR, American symbol; MFG: AVX/ELCO; MPN: 04025A220JAT2A; PACKAGE: 0402
C33 C34 = resistor:C-US: CAPACITOR, American symbol; MFG: MURATA; MPN: GRM188R60J106ME84D; PKG: 0603
C35-C38 = resistor:C-US: CAPACITOR, American symbol; MFG: MURATA; MPN: GRM188R60J226MEA0D; PKG: 0603
C41-C45 = resistor:C-US: CAPACITOR, American symbol; MFG: AVX; MPN: 04025A470JAT2A; PKG: 0402
C51 = resistor:C-US: CAPACITOR, American symbol; MFG: AVX; MPN: 0603YC224KAT2A; PKG: 0603
C57 = DDL:CAP_SMD_D_SIZED; MFG: KEMET; MPN: T520D337M006ATE045; PKG: Size D
C60 = resistor:C-US: CAPACITOR, American symbol; MFG: NIC; MPN: NMC0402NPO150J50TRPF; PKG: 0402
C61 = resistor:C-US: CAPACITOR, American symbol; MFG: MURATA; MPN: GRM1555C1H680JA01D; PKG: 0402
C77 = resistor:C-US: CAPACITOR, American symbol; MFG: AVX; MPN: DNI; PKG: 0402
D1-D3 D5-D8 = konekt:LED_0402_VLMW; MFG: VISHAY; MPN: VLMW1500-GS08; PACKAGE: 0402
F1 F3 F6 = DDL:FUSE_0603; MFG: Bourns; MPN: SF-0603S300-2; PKG: 0603
J1 = konekt:USB_MICRO_B_MOLEX_473460001; MFG: MOLEX; MPN: 473460001; PACKAGE: CUSTOM; PARTNUM: 473460001
J2 J9 = konekt:CON_JUMPER_1.27_2X2; MFG: FCI; MPN: 20021121-00004C4LF; PACKAGE: 1.27_2x2
J7 J8 = DDL:FTS-105; HEIGHT: 4.32; LENGTH: 6.35; MFG: SAMTEC; MPN: FTS-105-01-F-DV; MPN_DNI: FTS-105-01-F-DV; PACKAGE: FTS-105; PARTNUM: FTS-105-01-F-DV; WIDTH: 3.42
J20 = DDL:BAT_TERM; HEIGHT: 4.8; LENGTH: 9.6; MFG: JST; MPN: S2B-PH-SM4-TB(LF)(SN); PACKAGE: JST-2; PARTNUM: S2B-PH-SM4-TB(LF)(SN); WIDTH: 5.8
JB1 JB2 = konekt:JUMPER_1.27MM; MFG: HARWIN; MPN: M50-1920005; PACKAGE: M50
JLEFT_A JRIGHT_A = pinhead:PINHD-1X6: PIN HEADER; MFG: MOLEX; MPN: 22-28-4060; PACKAGE: CUSTOM
JLEFT_B JRIGHT_B = konekt:HEADER_0.1_IN_8_POS; MFG: MOLEX; MPN: 22-28-4080; PACKAGE: CUSTOM
L1 L3 = DDL:INDUCTOR_0603; MFG: Murata; MPN: BLM18AG121SN1D; PKG: 0603
L2 = DDL:INDUCTOR_0603; MFG: TDK; MPN: MPZ1608S221A; PKG: 0603
L4 = DDL:INDUCTOR_0402; MFG: TDK; MPN: DNI; MPN_DNI: MLK1005S8N2D; PKG: 0402; VAL: 8.2 nH
L5 = konekt:INDUCTOR_1UH_XFL4020-102MEC; MFG: COILCRAFT; MPN: XFL4020-102MEC; PACKAG: XFL4020
L6 = DDL:INDUCTOR_0603; MFG: TDK; MPN: DNI; MPN_DNI: MPZ1608S221A; PKG: 0603
L7 = DDL:INDUCTOR_0603; MFG: MURATA; MPN: BLM18EG221SN1D; PKG: 0603
L9 = DDL:INDUCTOR_0402; MFG: TDK; MPN: DNI; PARTNUM_DNI: MLK1005S8N2D; PKG: 0402; VAL: 8.2 nH
LISA1 = LISA:LISA-U200: U-blox LISA-U200; HEIGHT: 2.6; LENGTH: 33.2; MFG: UBLOX; MPN: LISA-U200-02S; PACKAGE: Custom; PARTNUM: Lisa-U200; WIDTH: 22.4
R1 R2 R4 R11 R13-R18 R21-R23 R25 R29-R33 R46 R48-R50 R54-R64 R66 R67 R69 R71 R73 R74 = GeneralLib:RESISTOR: Resistor; DESCRIPTION: Resistor, 1%, 0.125W; MANUFACTURER: Panasonic; MFG: PANASONIC; MPN: ERJ-2GE0R00X
R3 R41 R44 R68 = GeneralLib:RESISTOR: Resistor; DESCRIPTION: Resistor, 1%, 0.125W; MANUFACTURER: Panasonic; MFG: PANASONIC; MPN: DNI; MPN_DNI: ERJ-2GEJ750X
R5 R38 R39 R42 = GeneralLib:RESISTOR: Resistor; DESCRIPTION: Resistor, 1%, 0.125W; MANUFACTURER: Yaego; MFG: YAEGO; MPN: RC0402JR-071ML
R6 R20 R27 R28 R34 R36 R37 R72 = GeneralLib:RESISTOR: Resistor; DESCRIPTION: Resistor, 1%, 0.125W; MANUFACTURER: Panasonic; MFG: PANASONIC; MPN: DNI; MPN_DNI: ERJ-2GE0R00X
R7 R8 = GeneralLib:RESISTOR: Resistor; DESCRIPTION: Resistor, 1%, 0.125W; MANUFACTURER: Yaego; MFG: YAEGO; MPN: RC0402JR-0724KL
R9 = GeneralLib:RESISTOR: Resistor; DESCRIPTION: Resistor, 1%, 0.125W; MANUFACTURER: Yaego; MFG: YAEGO; MPN: RC0402JR-073K3L
R10 = GeneralLib:RESISTOR: Resistor; DESCRIPTION: Resistor, 1%, 0.125W; MANUFACTURER: Yaego; MFG: YAEGO; MPN: RC0402JR-071KL
R12 = resistor:R-US_: RESISTOR, American symbol; MFG: Panasonic; MPN: ERJ-2GEJ472X; PKG: 0402
R19 = resistor:R-US_: RESISTOR, American symbol; MFG: Panasonic; MPN: ERJ-2GEJ471X; PKG: 0402
R24 R35 R40 R47 = GeneralLib:RESISTOR: Resistor; DESCRIPTION: Resistor, 1%, 0.125W; MANUFACTURER: Yaego; MFG: YAEGO; MPN: RC0402JR-0710KL
R26 R65 = GeneralLib:RESISTOR: Resistor; DESCRIPTION: Resistor, 1%, 0.125W; MANUFACTURER: Panasonic; MFG: PANASONIC; MPN: ERJ-2GEJ750X
R43 = GeneralLib:RESISTOR: Resistor; DESCRIPTION: Resistor, 1%, 0.125W; MANUFACTURER: Panasonic; MFG: PANASONIC; MPN: DNI; MPN-DNI: ERJ-2GEJ750X
R45 = LooseLib1:RESISTOR; CROSS: YES; DESCRIPTION: Resistor, 5%, 0.1W; MFG: YAEGO; MPN: RC0402JR-071KL; POWER: 0.1W; PRODUCTION: YES; TOLERANCE: 5%
R51 R53 = resistor:R-US_: RESISTOR, American symbol; MFG: Panasonic; MPN: ERJ-2GEJ104X; PKG: 0402
R52 = resistor:R-US_: RESISTOR, American symbol; MFG: Panasonic; MPN: ERJ-2GEJ473X; PKG: 0402
R70 = GeneralLib:RESISTOR: Resistor; DESCRIPTION: Resistor, 1%, 0.125W; MANUFACTURER: Panasonic; MFG: PANASONIC; MPN: DNI
R2000 = GeneralLib:RESISTOR: Resistor; DESCRIPTION: Resistor, 1%, 0.125W; MANUFACTURER: Yaego; MFG: YAEGO; MPN: RC0402JR-07470RL
RN1 = resistor-dil:4R-N: Array Chip Resistor Source: RS Component / Phycomp; MFG: BOURNES; MPN: CAY16-220J4LF; OC_FARNELL: unknown; OC_NEWARK: unknown; PACKAGE: CAY16; PARTNUM: CAY16-220J4LF
SARA1 = GeneralLib:SARA-U2XX; MFG: U-BLOX; MPN: DNI; PACKAGE: LGA-91; PARTNUMBER: SARA-U260
SIM1 = konekt:SIM_CARD_NANO_GLOBAL_CONNECTOR_TEC_SIM8050-6-0-14-01-A; MFG: Global Connector Technology; MPN: SIM8050-06-14-01-A
SW_PGM SW_SYS_RST SW_USR_RST = konekt:SWITCH_PANASONIC_EVP-BB2A1B000; MFG: PANASONIC; MPN: EVP-BB2A1B000; PACKAGE: EVP-BB
T2 = transistor:BC846: NPN TRANSISTOR; MFG: ON SEMI; MPN: BC846ALT1G; PKG: SOT23
TP1 TP2 TP4-TP9 TP13-TP15 TP17-TP28 TP30 = testpad:TP: Test pad; MFG: N/A; MPN: N/A
TP3 = testpad:TPS: TEST PIN; MFG: N/A; MPN: N/A
U1 = konekt:ST_MICRO_BAT_CHARGER_L6924U013; MFG: ST Micro; MPN: L6924UTR; PACKAGE: VFQFPN16; PARTNUM: L6924UTR
U2 = konekt:TPS63021; MFG: TI; MPN: TPS63021DSJR; PACKAGE: QFN_14_3x4
U3 = konekt:MICROCHIP_FLASH_MEM; MFG: MICROCHIP; MPN: SST26VF016BT-104I/MF; PACKAGE: WDFN_5x6_MF
U4 = konekt:DIODE_DUAL_SCHOTKEY; MFG: FAIRCHILD; MPN: BAT54C; MPN_DNI: BAT54C; PACKAGE: SOT23
U5 = TeensyCustom:MK20DX128VLH5: Teensy 3.0 Processing Unit - MK20DX128VLH5 ARM Cortex M0 Datasheet: http://cache.freescale.com/files/32bit/doc/data_sheet/K20P64M50SF0.pdf; MFG: Freescale; MPN: MK22FN1M0VLH12; PACKAGE: LQFP-64
U6 = konekt:FREESCALE_MKL17Z256VFM4; MFG: FREESCALE; MPN: MKL17Z256VFM4; PACKAGE: QFN32_5x5
U7 U9 = DDL:PESD12VL2BT,215; MFG: NXP; MPN: PESD12VL2BT,215; PACKAGE: SOT23; PARTNUM: PESD12VL2BT,215
U8 = konekt:VOLTAGE_TRANSLATOR_4_BIT; MFG: TI; MPN: SN74AVC4T774RSVR; PACKAGE: UQFN_16
U10 = konekt:BOOST_5V_TI_TPS81256; MFG: TI; MPN: TPS81256SIPT; PACKAGE: 9-uSiP
U19 = MAX1704:MAX1704X: MAX17043/MAX17044: Battery Fuel Guage (43 is 1cell, 44 is 2cell); CROSS: NO; DESCRIPTION: Battery Fuel Gauge; MFG: Maxim; MPN: MAX17043G+U; PRODUCTION: YES
X1 = konekt:CERAMIC_RESONATOR_16MHZ_MURATA_CSTCE; MFG: MURATA; MPN: CSTCE16M0V53-R0; PACKAGE: CTSCE
X2 X3 = konekt:CRYSTAL_32.768K_AVX; MFG: AVX/ELCO/KYOCERA; MPN: ST3215SB32768E0HPWBB; PACKAGE: ST3215SB

## Net classes
1 power: width 0.406 mm, drill 0.61 mm, clearance 0.152 mm
2 gnd: width 0.203 mm, drill 0.203 mm, clearance 0.152 mm
3 usbvcc: width 0.203 mm, drill 0.61 mm, clearance 0.152 mm
4 aref: width 0.203 mm, drill 0.61 mm, clearance 0.152 mm
5 Vbatt: width 2.5 mm, drill 1 mm, clearance 0.125 mm
6 HIGH_SPEED: width 0.155 mm, drill 0.203 mm, clearance 0.152 mm
7 DIFF_HIGH_SPEED: width 0.157 mm, drill 0.203 mm, clearance 0.152 mm